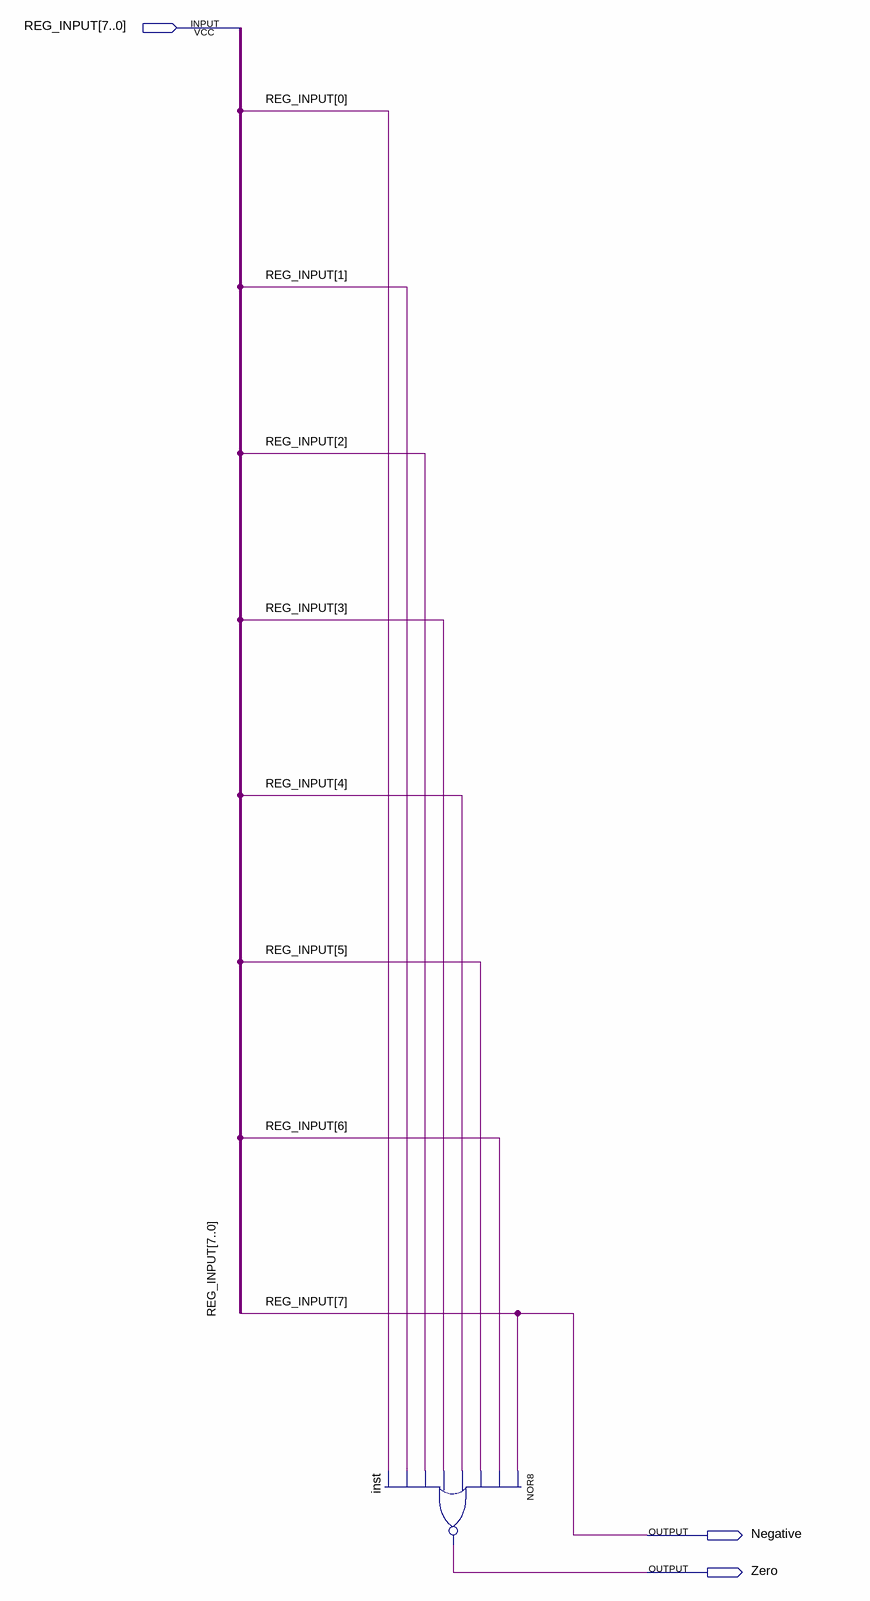
[diagram p0: schematic sheet]
// Quartus schematic ALU_Flag_Calculator.bdf as structural Verilog: 1 symbols, 3 pins
module ALU_Flag_Calculator (
  input  [7:0] REG_INPUT,
  output Negative,
  output Zero
);

  nor inst (Zero, REG_INPUT[7], REG_INPUT[6], REG_INPUT[5], REG_INPUT[4], REG_INPUT[3], REG_INPUT[2], REG_INPUT[1], REG_INPUT[0]);

  assign Negative = REG_INPUT[7];
endmodule
